# EAGLE schematic Mainboard33WithHeadersv5 (EAGLE 6.3)
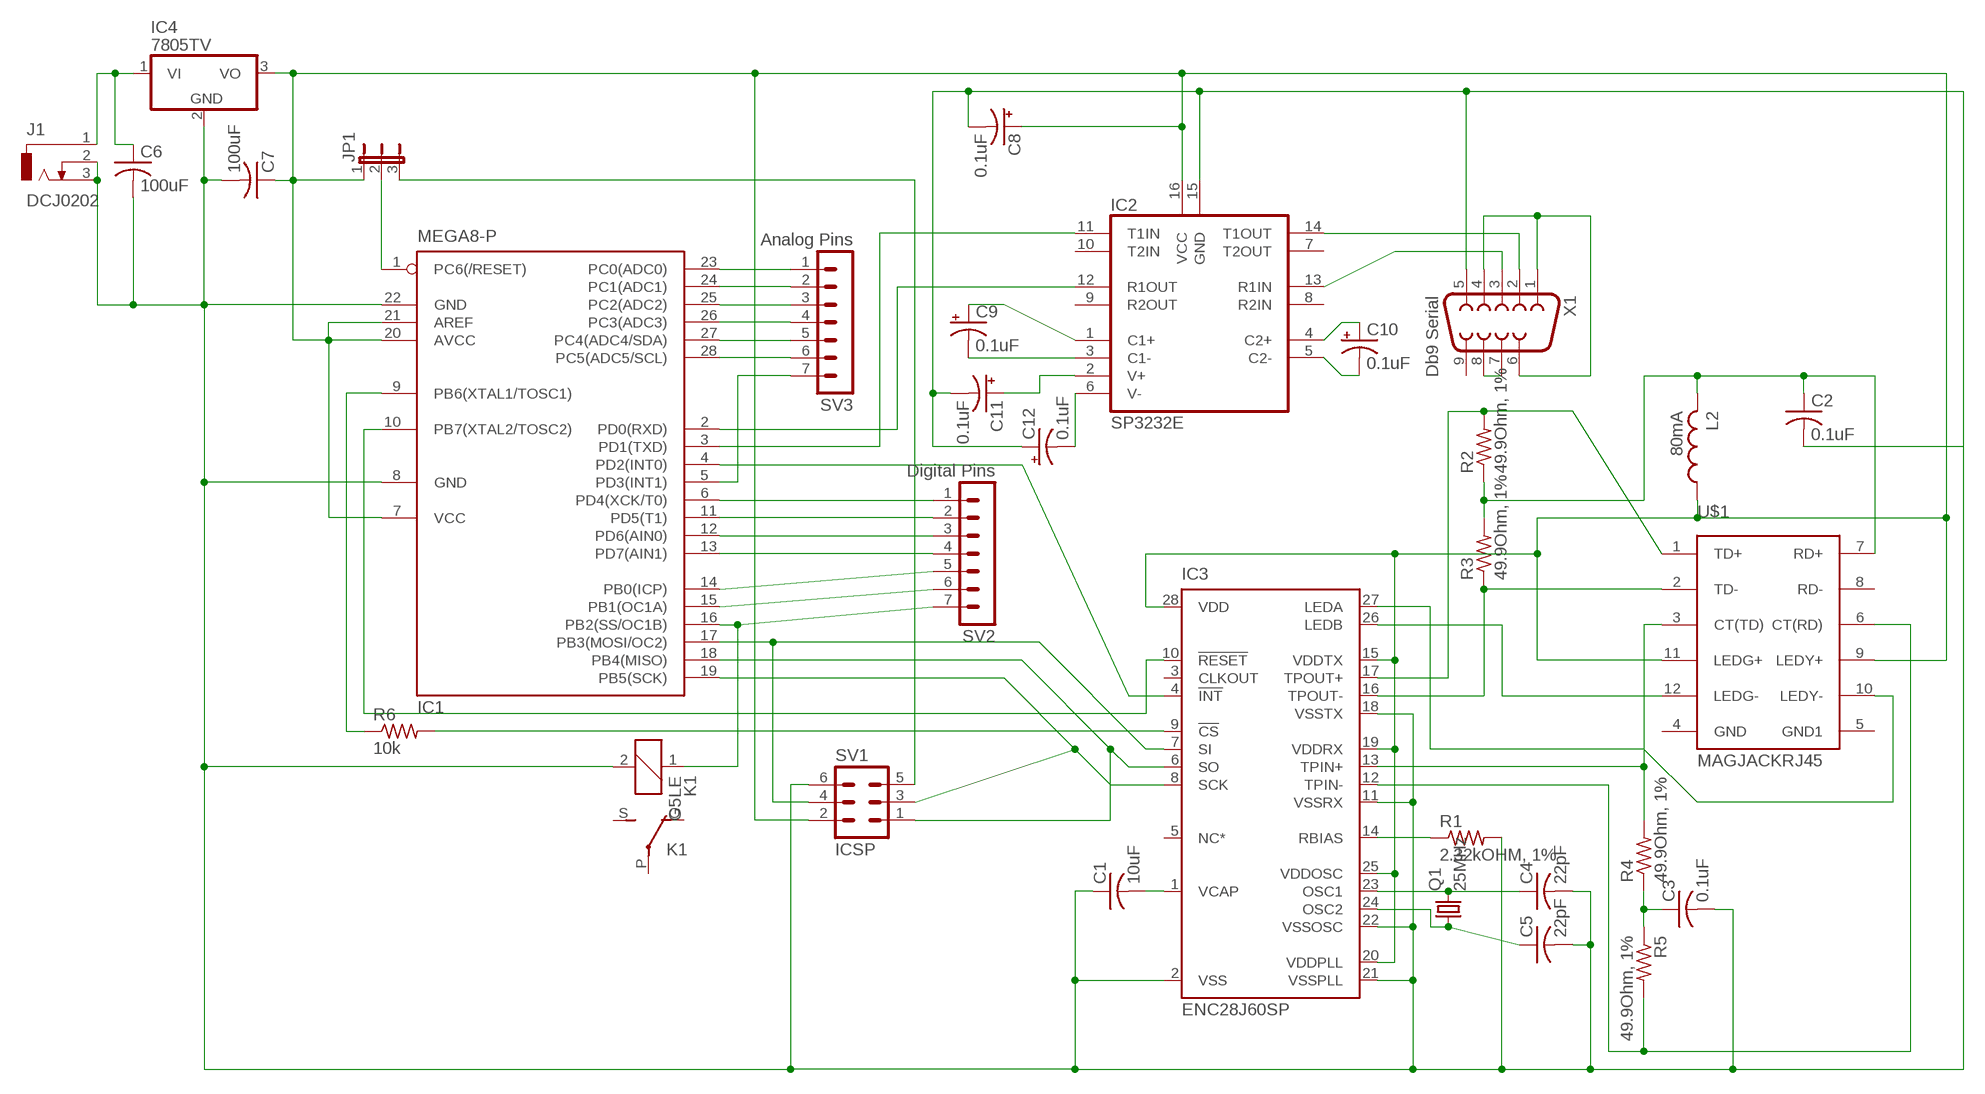
[diagram p0: schematic, sheet 1]

## Parts
C1  10uF  C-US050-024X044  [C050-024X044]
C2  0.1uF  C-US050-024X044  [C050-024X044]
C3  0.1uF  C-US050-024X044  [C050-024X044]
C4  22pF  C-US050-024X044  [C050-024X044]
C5  22pF  C-US050-024X044  [C050-024X044]
C6  100uF  C-US050-030X075  [C050-030X075]
C7  100uF  C-US050-035X075  [C050-035X075]
C8  0.1uF  CPOL-USE1.8-4  [E1,8-4]
C9  0.1uF  CPOL-USE1.8-4  [E1,8-4]
C10  0.1uF  CPOL-USE1.8-4  [E1,8-4]
C11  0.1uF  CPOL-USE1.8-4  [E1,8-4]
C12  0.1uF  CPOL-USE1.8-4  [E1,8-4]
IC1  MEGA8-P  [DIL28-3]
IC2  SP3232E  SP3232ESP3232E  [DIL16]
IC3  ENC28J60SP  [DIL28-3]
IC4  7805TV  [TO220V]
J1  DCJ0202  [DCJ0202]
JP1  JP2E  [JP2]
K1  G5LE  [G5LE]
L2  80mA  L-US0207/10  [0207/10]
Q1  25MHz  CRYSTALHC49S  [HC49/S]
R1  2.32kOHM, 1%  R-US_0204/5  [0204/5]
R2  49.9Ohm, 1%  R-US_0204/5  [0204/5]
R3  49.9Ohm, 1%  R-US_0204/5  [0204/5]
R4  49.9Ohm, 1%  R-US_0204/5  [0204/5]
R5  49.9Ohm, 1%  R-US_0204/5  [0204/5]
R6  10k  R-US_0204/5  [0204/5]
SV1  ICSP  MA03-2  [MA03-2]
SV2  Digital Pins  MA07-1  [MA07-1]
SV3  Analog Pins  MA07-1  [MA07-1]
U$1  MAGJACKRJ45  [MAGJACK]
X1  Db9 Serial  F09H  [F09H]

## Nets
N$1: IC1.19(PB5(SCK)) IC3.8(SCK) SV1.3
N$2: IC1.17(PB3(MOSI/OC2)) IC3.7(SI) SV1.4
N$3: C1.2 IC3.1(VCAP)
N$4: IC3.9(!CS) R6.2
N$5: IC1.18(PB4(MISO)) IC3.6(SO) SV1.1
N$6: IC1.12(PD6(AIN0)) SV2.3
N$7: IC1.10(PB7(XTAL2/TOSC2)) IC3.10(!RESET)
N$8: IC3.14(RBIAS) R1.1
N$9: C6.1 IC4.1(VI) J1.1
N$10: IC3.17(TPOUT+) R2.2 U$1.1(TD+)
N$11: IC3.16(TPOUT-) R3.1 U$1.2(TD-)
N$12: C3.1 R4.1 R5.1
N$14: IC3.13(TPIN+) R4.2 U$1.3(CT(TD))
N$15: IC3.12(TPIN-) R5.2 U$1.6(CT(RD))
N$16: IC3.26(LEDB) U$1.12(LEDG-)
N$17: IC3.27(LEDA) U$1.10(LEDY-)
N$18: IC1.2(PD0(RXD)) IC2.12(R1OUT)
N$19: IC1.3(PD1(TXD)) IC2.11(T1IN)
N$20: C7.1 C8.+ IC1.7(VCC) IC1.20(AVCC) IC1.21(AREF) IC2.16(VCC) IC3.15(VDDTX) IC3.19(VDDRX) IC3.20(VDDPLL) IC3.25(VDDOSC) IC3.28(VDD) IC4.3(VO) JP1.1 L2.1 SV1.2 U$1.9(LEDY+) U$1.11(LEDG+)
N$21: IC1.4(PD2(INT0)) IC3.4(!INT)
N$22: IC1.9(PB6(XTAL1/TOSC1)) R6.1
N$23: IC2.13(R1IN) X1.3
N$24: C12.- IC2.6(V-)
N$25: X1.7 X1.8
N$26: X1.1 X1.4 X1.6
N$27: JP1.3 SV1.5
N$28: IC1.11(PD5(T1)) SV2.2
N$29: C4.1 IC3.23(OSC1) Q1.2
N$30: IC1.1(PC6(/RESET)) JP1.2
N$31: IC1.6(PD4(XCK/T0)) SV2.1
N$32: C5.1 IC3.24(OSC2) Q1.1
N$33: C9.+ IC2.1(C1+)
N$34: IC1.23(PC0(ADC0)) SV3.1
N$35: IC1.24(PC1(ADC1)) SV3.2
N$36: IC1.25(PC2(ADC2)) SV3.3
N$37: IC1.26(PC3(ADC3)) SV3.4
N$38: IC1.27(PC4(ADC4/SDA)) SV3.5
N$39: IC1.28(PC5(ADC5/SCL)) SV3.6
N$40: IC1.5(PD3(INT1)) SV3.7
N$41: IC1.13(PD7(AIN1)) SV2.4
N$42: IC1.14(PB0(ICP)) SV2.5
N$43: IC1.15(PB1(OC1A)) SV2.6
N$44: IC1.16(PB2(SS/OC1B)) K1.1 SV2.7
N$45: C9.- IC2.3(C1-)
N$46: C10.+ IC2.4(C2+)
N$47: IC2.14(T1OUT) X1.2
N$48: C1.1 C2.2 C3.2 C4.2 C5.2 C6.2 C7.2 C8.- C11.- C12.+ IC1.8(GND) IC1.22(GND) IC2.15(GND) IC3.2(VSS) IC3.11(VSSRX) IC3.18(VSSTX) IC3.21(VSSPLL) IC3.22(VSSOSC) IC4.2(GND) J1.2 J1.3 K1.2 R1.2 SV1.6 X1.5
N$49: C10.- IC2.5(C2-)
N$50: C11.+ IC2.2(V+)
N$51: C2.1 L2.2 R2.1 R3.2 U$1.7(RD+)
Unconnected: IC2.7(T2OUT) IC2.8(R2IN) IC2.9(R2OUT) IC2.10(T2IN) IC3.3(CLKOUT) IC3.5(NC*) K1.O(2:O) K1.P(2:P) K1.S(2:S) U$1.8(RD-) X1.9

## Power pins joined to a net without a drawn wire
GND: U$1.4(GND)
GND1: U$1.5(GND1)

## Library data of the parts
C1-C7 = rcl:C-US: CAPACITOR, American symbol
C8-C12 = rcl:CPOL-US: POLARIZED CAPACITOR, American symbol
IC1 = atmel:MEGA8-P: MICROCONTROLLER 8 Kbytes FLASH, 1 kbytes SRAM, 512 bytes EEPROM, USART, 4-channel 10 bit ADC, 2-channel 8 bit ADC Pin compatible with Atmega48, ATMega88, ATMega168 Source: avr.lbr; OC_FARNELL: unknown; OC_NEWARK: unknown
IC2 = exar-extended:SP3232E: RS-232 level converter
IC3 = microchip:ENC28J60: Stand-Alone Ethernet Controller with SPI Interface Source: http://ww1.microchip.com/downloads/en/DeviceDoc/39662c.pdf; MF: MICROCHIP; MPN: ENC28J60/SP; OC_FARNELL: 1084619; OC_NEWARK: 96K3661
IC4 = linear:78*: Positive VOLTAGE REGULATOR Source: http://cache.national.com/ds/LM/LM78L05.pdf http://www.fairchildsemi.com/ds/LM/LM7805.pdf
J1 = con-jack:DCJ0202: DC POWER JACK Source: DCJ0202.pdf; OC_FARNELL: unknown; OC_NEWARK: unknown
JP1 = jumper:JP2E: JUMPER
K1 = relay:G5LE: RELAY 1 x switch, 10 A/120 V AC, 8 A/30 V DC, Omron; OC_FARNELL: unknown; OC_NEWARK: unknown
L2 = resistor:L-US: INDUCTOR, American symbol
Q1 = crystal:CRYSTAL: CRYSTAL; OC_FARNELL: 1667008; OC_NEWARK: unknown
R1-R5 = resistor:R-US_: RESISTOR, American symbol
R6 = rcl:R-US_: RESISTOR, American symbol
SV1 = con-lstb:MA03-2: PIN HEADER; OC_FARNELL: unknown; OC_NEWARK: unknown
SV2 SV3 = con-lstb:MA07-1: PIN HEADER; OC_FARNELL: unknown; OC_NEWARK: unknown
U$1 = magjack:MAGJACK: MORETHANALL MagJack RJ45 with built-in magnetics. Part no. MJF13T3L-KF06B3YG-0808
X1 = con-subd:F09: SUB-D; OC_FARNELL: unknown; OC_NEWARK: unknown